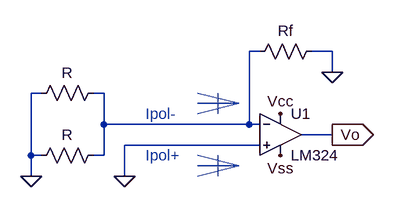
[diagram p0: schematic Circuito Error CC.asc]
Circuito Error CC.asc, the LTspice schematic file:
Version 4
SHEET 1 1560 680
WIRE 464 -240 448 -240
WIRE 576 -240 544 -240
WIRE 576 -208 576 -240
WIRE 128 -176 112 -176
WIRE 224 -176 208 -176
WIRE 224 -128 224 -176
WIRE 448 -128 448 -240
WIRE 448 -128 224 -128
WIRE 464 -128 448 -128
WIRE 576 -112 528 -112
WIRE 464 -96 256 -96
WIRE 112 -80 112 -176
WIRE 128 -80 112 -80
WIRE 224 -80 224 -128
WIRE 224 -80 208 -80
WIRE 112 -48 112 -80
WIRE 256 -48 256 -96
FLAG 256 -48 0
FLAG 496 -144 Vcc
FLAG 496 -80 Vss
FLAG 576 -112 Vo
IOPIN 576 -112 Out
FLAG 112 -48 0
FLAG 576 -208 0
SYMBOL OpAmps\\opamp2 496 -176 R0
SYMATTR InstName U1
SYMATTR Value LM324
SYMBOL res 112 -160 R270
WINDOW 0 32 56 VTop 2
WINDOW 3 0 56 VBottom 2
SYMATTR InstName R
SYMATTR Value ""
SYMBOL res 112 -64 R270
WINDOW 0 32 56 VTop 2
WINDOW 3 0 56 VBottom 2
SYMATTR InstName R
SYMATTR Value ""
SYMBOL res 560 -256 R90
WINDOW 0 0 56 VBottom 2
WINDOW 3 32 56 VTop 2
SYMATTR InstName Rf
SYMATTR Value ""
TEXT 288 -144 Left 2 ;Ipol-
TEXT 288 -80 Left 2 ;Ipol+
LINE Normal 432 -160 368 -160
LINE Normal 400 -144 400 -176
LINE Normal 368 -144 432 -160
LINE Normal 432 -160 368 -176
LINE Normal 432 -64 368 -64
LINE Normal 400 -48 400 -80
LINE Normal 368 -48 432 -64
LINE Normal 432 -64 368 -80

The netlist it stands for:
* Circuito Error CC.asc
XU1 0 N001 Vcc Vss Vo LM324  ; pins In+ In- V+ V- OUT
R 0 N001
R 0 N001
Rf 0 N001
* Ipol-
* Ipol+
.backanno
.end